# Altium project PogoBattPack.PrjPcb
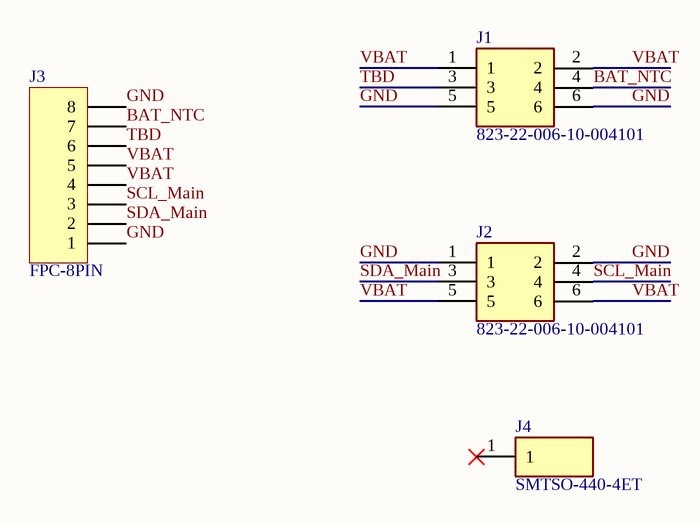
[diagram p0: PogoBattPack.SchDoc]
1 sheet, 4 parts. Net scope: global (net labels, ports and power ports of the same name join across sheets).
Board file: PogoBattPack.PcbDoc

## Sheet PogoBattPack.SchDoc
size A4

### Parts
J1  823-22-006-10-004101  [HDRV6W43P254_2X3_762X508X599P]
J2  823-22-006-10-004101  [HDRV6W43P254_2X3_762X508X599P]
J3  FPC-8PIN  [FPC-PCB-8PIN]
J4  SMTSO-440-4ET  [SMTSO-440-4ET]

### Nets
BAT_NTC: J1.4 J3.7
GND: J1.5 J1.6 J2.1 J2.2 J3.1 J3.8
SCL_Main: J2.4 J3.3
SDA_Main: J2.3 J3.2
TBD: J1.3 J3.6
VBAT: J1.1 J1.2 J2.5 J2.6 J3.4 J3.5

Not connected (* = marked no-connect by the designer): J4 1*

### Library data of the parts
J1 J2 = 823-22-006-10-004101: Connector; Manufacturer_Name: Mill-Max; Datasheet Link: https://www.arrow.com/en/products/8232200610004101/mill-max; Height: 5.994mm; Manufacturer_Part_Number: 823-22-006-10-004101; Mouser Part Number: 575-8232200610004101; Mouser Price/Stock: https://www.mouser.co.uk/ProductDetail/Mill-Max/823-22-006-10-004101?qs=iJx90KzHWBqGX45BMLpjyA%3D%3D; Arrow Part Number: 823-22-006-10-004101; Arrow Price/Stock: https://www.arrow.com/en/products/8232200610004101/mill-max
J3 = Header 8: Header, 8-Pin; LatestRevisionDate: 17-Jul-2002; LatestRevisionNote: Re-released for DXP Platform.; Publisher: Altium Limited
J4 = SMTSO-440-4ET: Connector; Manufacturer_Name: Wurth Elektronik; Manufacturer_Part_Number: 746600330R; Datasheet Link: https://www.mouser.com/datasheet/2/445/746600330R-1095622.pdf; Height: 4mm; Mouser Part Number: 710-746600330R; Mouser Price/Stock: https://www.mouser.co.uk/ProductDetail/Wurth-Elektronik/746600330R?qs=lBTPRtX1sU8mwfQdkSz5%2FQ%3D%3D